# Altium schematic sheet Sheet1.SchDoc
size A4
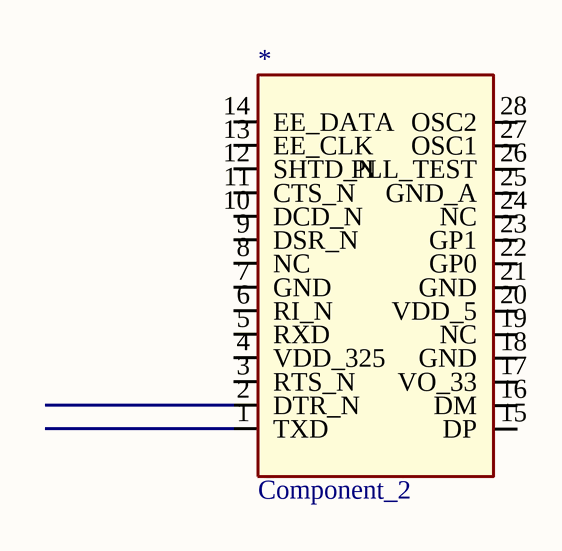
[diagram p0: Sheet1.SchDoc]

## Parts
*  Component_2  [PL2303HX]

## Nets

Not connected (* = marked no-connect by the designer): * 1(TXD) 2(DTR_N) 3(RTS_N) 4(VDD_325) 5(RXD) 6(RI_N) 7(GND) 8(NC) 9(DSR_N) 10(DCD_N) 11(CTS_N) 12(SHTD_N) 13(EE_CLK) 14(EE_DATA) 15(DP) 16(DM) 17(VO_33) 18(GND) 19(NC) 20(VDD_5) 21(GND) 22(GP0) 23(GP1) 24(NC) 25(GND_A) 26(PLL_TEST) 27(OSC1) 28(OSC2)